# Altium schematic sheet main.SchDoc: Main
size A4; Revision: 1.0.0; SheetNumber: 1; SheetTotal: 10
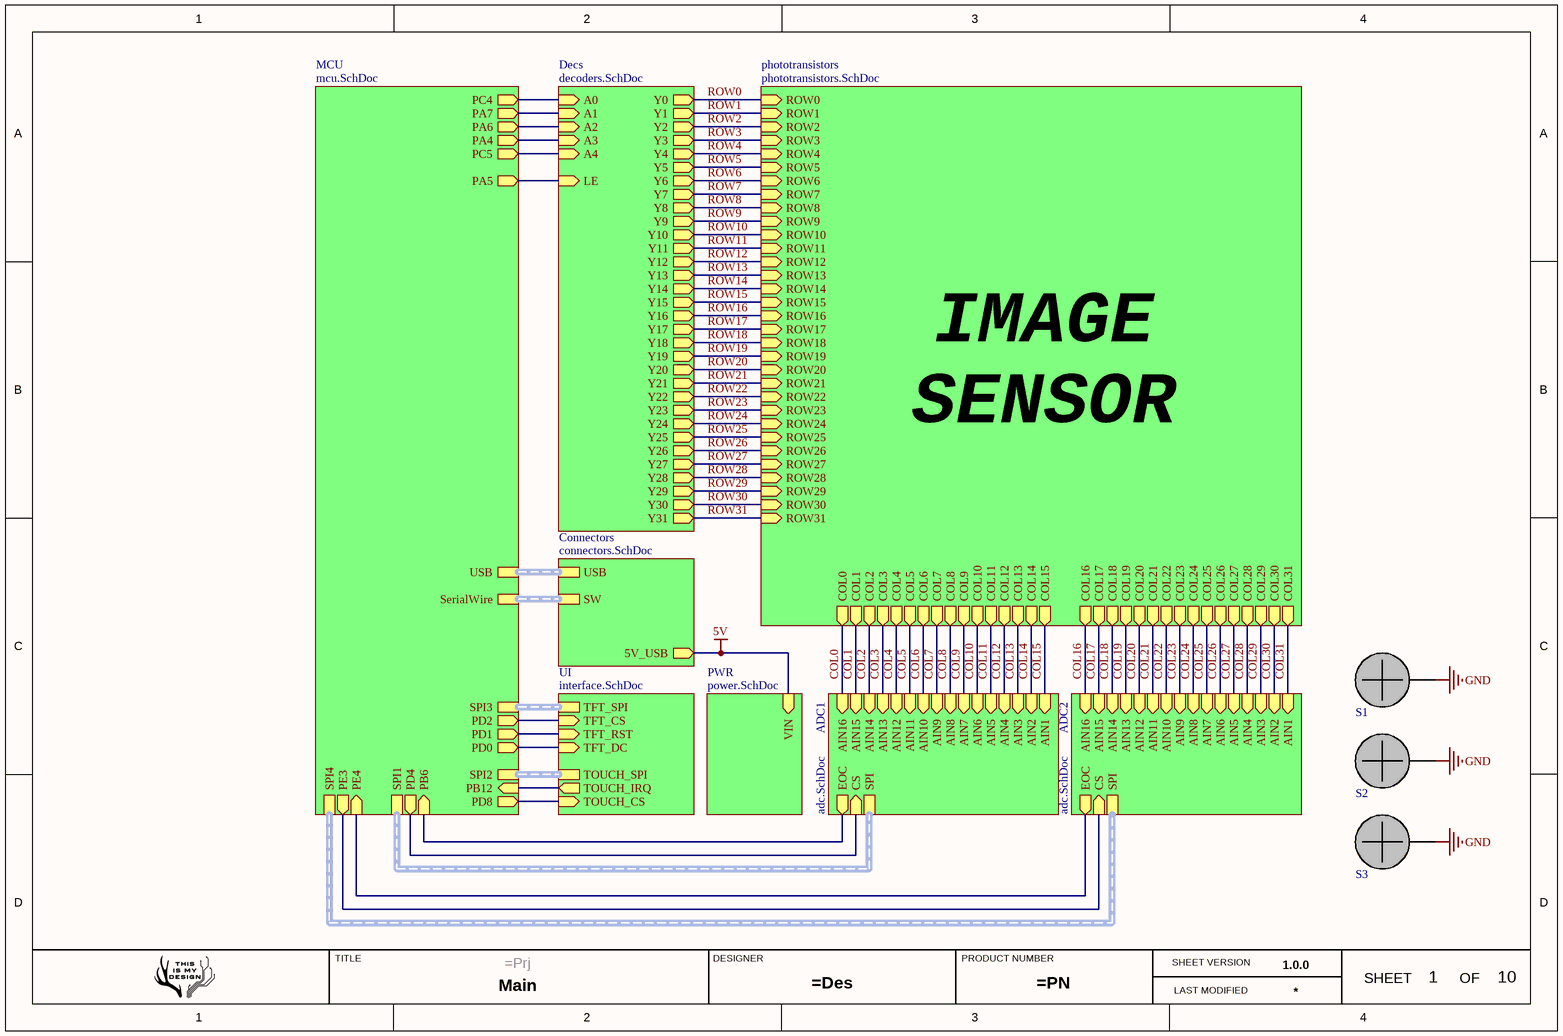
[diagram p0: main.SchDoc]

## Parts
S1  Screw  [M3]  (value not drawn)  (no BOM)
S2  Screw  [M3]  (value not drawn)  (no BOM)
S3  Screw  [M3]  (value not drawn)  (no BOM)

## Sub-sheets
ADC1 = adc.SchDoc: AIN1 (in), AIN2 (in), AIN3 (in), AIN4 (in), AIN5 (in), AIN6 (in), AIN7 (in), AIN8 (in), AIN9 (in), AIN10 (in), AIN11 (in), AIN12 (in), AIN13 (in), AIN14 (in), AIN15 (in), AIN16 (in), CS (in), EOC (out), SPI (harness SPI)
ADC2 = adc.SchDoc: AIN1 (in), AIN2 (in), AIN3 (in), AIN4 (in), AIN5 (in), AIN6 (in), AIN7 (in), AIN8 (in), AIN9 (in), AIN10 (in), AIN11 (in), AIN12 (in), AIN13 (in), AIN14 (in), AIN15 (in), AIN16 (in), CS (in), EOC (out), SPI (harness SPI)
Connectors = connectors.SchDoc: USB (harness USB), 5V_USB (out), SW (harness SerialWire)
Decs = decoders.SchDoc: Y0 (out), Y1 (out), Y2 (out), Y3 (out), Y4 (out), Y5 (out), Y6 (out), Y7 (out), Y8 (out), Y9 (out), Y10 (out), Y11 (out), Y12 (out), Y13 (out), Y14 (out), Y15 (out), Y16 (out), Y17 (out), Y18 (out), Y19 (out), Y20 (out), Y21 (out), Y22 (out), Y23 (out), Y24 (out), Y25 (out), Y26 (out), Y27 (out), Y28 (out), Y29 (out), Y30 (out), Y31 (out), A0 (in), A1 (in), A2 (in), A3 (in), A4 (in), LE (in)
MCU = mcu.SchDoc: SPI1 (harness SPI), SPI4 (harness SPI), SPI2 (harness SPI), SPI3 (harness SPI), USB (harness USB), SerialWire (harness SerialWire), PD8 (out), PD0 (out), PD1 (out), PD2 (out), PB12 (in), PA4 (out), PA5 (out), PA6 (out), PA7 (out), PC4 (out), PC5 (out), PB6 (in), PD4 (out), PE4 (in), PE3 (out)
phototransistors = phototransistors.SchDoc: ROW1 (in), ROW2 (in), ROW3 (in), ROW4 (in), ROW5 (in), ROW6 (in), ROW7 (in), ROW8 (in), ROW9 (in), ROW10 (in), ROW11 (in), ROW12 (in), ROW13 (in), ROW14 (in), ROW15 (in), ROW16 (in), ROW17 (in), ROW18 (in), ROW19 (in), ROW20 (in), ROW21 (in), ROW22 (in), ROW23 (in), ROW24 (in), ROW25 (in), ROW26 (in), ROW27 (in), ROW28 (in), ROW29 (in), ROW30 (in), ROW31 (in), ROW0 (in), COL1 (out), COL2 (out), COL3 (out), COL4 (out), COL5 (out), COL6 (out), COL7 (out), COL8 (out), COL9 (out), COL10 (out), COL11 (out), COL12 (out), COL13 (out), COL14 (out), COL15 (out), COL0 (out), COL16 (out), COL17 (out), COL18 (out), COL19 (out), COL20 (out), COL21 (out), COL22 (out), COL23 (out), COL24 (out), COL25 (out), COL26 (out), COL27 (out), COL28 (out), COL29 (out), COL30 (out), COL31 (out)
PWR = power.SchDoc: VIN (in)
UI = interface.SchDoc: TFT_CS (in), TFT_RST (in), TFT_DC (in), TOUCH_CS (in), TOUCH_IRQ (out), TFT_SPI (harness SPI), TOUCH_SPI (harness SPI)

## Nets
5V: sheet PWR/VIN, sheet Connectors/5V_USB
GND: S1.0 S2.0 S3.0
COL0: sheet phototransistors/COL0, sheet ADC1/AIN16
COL1: sheet phototransistors/COL1, sheet ADC1/AIN15
COL2: sheet phototransistors/COL2, sheet ADC1/AIN14
COL3: sheet phototransistors/COL3, sheet ADC1/AIN13
COL4: sheet phototransistors/COL4, sheet ADC1/AIN12
COL5: sheet phototransistors/COL5, sheet ADC1/AIN11
COL6: sheet phototransistors/COL6, sheet ADC1/AIN10
COL7: sheet phototransistors/COL7, sheet ADC1/AIN9
COL8: sheet phototransistors/COL8, sheet ADC1/AIN8
COL9: sheet phototransistors/COL9, sheet ADC1/AIN7
COL10: sheet phototransistors/COL10, sheet ADC1/AIN6
COL11: sheet phototransistors/COL11, sheet ADC1/AIN5
COL12: sheet phototransistors/COL12, sheet ADC1/AIN4
COL13: sheet phototransistors/COL13, sheet ADC1/AIN3
COL14: sheet phototransistors/COL14, sheet ADC1/AIN2
COL15: sheet phototransistors/COL15, sheet ADC1/AIN1
COL16: sheet phototransistors/COL16, sheet ADC2/AIN16
COL17: sheet phototransistors/COL17, sheet ADC2/AIN15
COL18: sheet phototransistors/COL18, sheet ADC2/AIN14
COL19: sheet phototransistors/COL19, sheet ADC2/AIN13
COL20: sheet phototransistors/COL20, sheet ADC2/AIN12
COL21: sheet phototransistors/COL21, sheet ADC2/AIN11
COL22: sheet phototransistors/COL22, sheet ADC2/AIN10
COL23: sheet phototransistors/COL23, sheet ADC2/AIN9
COL24: sheet phototransistors/COL24, sheet ADC2/AIN8
COL25: sheet phototransistors/COL25, sheet ADC2/AIN7
COL26: sheet phototransistors/COL26, sheet ADC2/AIN6
COL27: sheet phototransistors/COL27, sheet ADC2/AIN5
COL28: sheet phototransistors/COL28, sheet ADC2/AIN4
COL29: sheet phototransistors/COL29, sheet ADC2/AIN3
COL30: sheet phototransistors/COL30, sheet ADC2/AIN2
COL31: sheet phototransistors/COL31, sheet ADC2/AIN1
ROW0: sheet phototransistors/ROW0, sheet Decs/Y0
ROW1: sheet phototransistors/ROW1, sheet Decs/Y1
ROW2: sheet phototransistors/ROW2, sheet Decs/Y2
ROW3: sheet phototransistors/ROW3, sheet Decs/Y3
ROW4: sheet phototransistors/ROW4, sheet Decs/Y4
ROW5: sheet phototransistors/ROW5, sheet Decs/Y5
ROW6: sheet phototransistors/ROW6, sheet Decs/Y6
ROW7: sheet phototransistors/ROW7, sheet Decs/Y7
ROW8: sheet phototransistors/ROW8, sheet Decs/Y8
ROW9: sheet phototransistors/ROW9, sheet Decs/Y9
ROW10: sheet phototransistors/ROW10, sheet Decs/Y10
ROW11: sheet phototransistors/ROW11, sheet Decs/Y11
ROW12: sheet phototransistors/ROW12, sheet Decs/Y12
ROW13: sheet phototransistors/ROW13, sheet Decs/Y13
ROW14: sheet phototransistors/ROW14, sheet Decs/Y14
ROW15: sheet phototransistors/ROW15, sheet Decs/Y15
ROW16: sheet phototransistors/ROW16, sheet Decs/Y16
ROW17: sheet phototransistors/ROW17, sheet Decs/Y17
ROW18: sheet phototransistors/ROW18, sheet Decs/Y18
ROW19: sheet phototransistors/ROW19, sheet Decs/Y19
ROW20: sheet phototransistors/ROW20, sheet Decs/Y20
ROW21: sheet phototransistors/ROW21, sheet Decs/Y21
ROW22: sheet phototransistors/ROW22, sheet Decs/Y22
ROW23: sheet phototransistors/ROW23, sheet Decs/Y23
ROW24: sheet phototransistors/ROW24, sheet Decs/Y24
ROW25: sheet phototransistors/ROW25, sheet Decs/Y25
ROW26: sheet phototransistors/ROW26, sheet Decs/Y26
ROW27: sheet phototransistors/ROW27, sheet Decs/Y27
ROW28: sheet phototransistors/ROW28, sheet Decs/Y28
ROW29: sheet phototransistors/ROW29, sheet Decs/Y29
ROW30: sheet phototransistors/ROW30, sheet Decs/Y30
ROW31: sheet phototransistors/ROW31, sheet Decs/Y31
(unnamed): sheet ADC1/CS, sheet MCU/PD4
(unnamed): sheet ADC1/EOC, sheet MCU/PB6
(unnamed): sheet ADC2/CS, sheet MCU/PE3
(unnamed): sheet ADC2/EOC, sheet MCU/PE4
(unnamed): sheet Decs/A0, sheet MCU/PC4
(unnamed): sheet Decs/A1, sheet MCU/PA7
(unnamed): sheet Decs/A2, sheet MCU/PA6
(unnamed): sheet Decs/A3, sheet MCU/PA4
(unnamed): sheet Decs/A4, sheet MCU/PC5
(unnamed): sheet Decs/LE, sheet MCU/PA5
(unnamed): sheet MCU/PD8, sheet UI/TOUCH_CS
(unnamed): sheet MCU/PD0, sheet UI/TFT_DC
(unnamed): sheet MCU/PD1, sheet UI/TFT_RST
(unnamed): sheet MCU/PD2, sheet UI/TFT_CS
(unnamed): sheet MCU/PB12, sheet UI/TOUCH_IRQ

## Buses and harness runs
harness sheet ADC1/SPI = sheet MCU/SPI1
harness sheet ADC2/SPI = sheet MCU/SPI4
harness sheet Connectors/SW = sheet MCU/SerialWire
harness sheet Connectors/USB = sheet MCU/USB
harness sheet MCU/SPI2 = sheet UI/TOUCH_SPI
harness sheet MCU/SPI3 = sheet UI/TFT_SPI

## Notes on the sheet
- IMAGE
  SENSOR
- TITLE
- DESIGNER
- PRODUCT NUMBER
- SHEET VERSION
- LAST MODIFIED
- SHEET
- OF